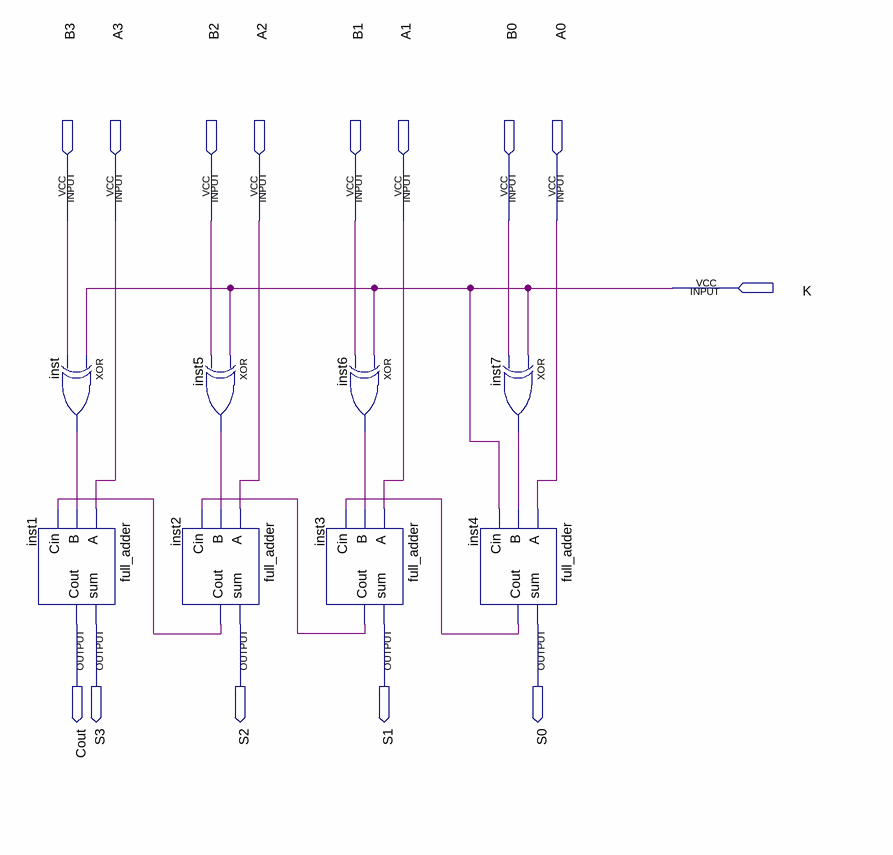
[diagram p0: schematic sheet]
// Quartus schematic FSA.bdf as structural Verilog: 8 symbols, 14 pins
module FSA (
  input  B3,
  input  A3,
  input  B2,
  input  A2,
  input  B1,
  input  A1,
  input  B0,
  input  A0,
  input  K,
  output Cout,
  output S3,
  output S2,
  output S1,
  output S0
);

  wire inst2_cout, inst3_cout, inst4_cout, inst5_out, inst6_out, inst7_out, inst_out;

  xor inst (inst_out, K, B3);
  full_adder inst1 (.A(A3), .B(inst_out), .Cin(inst2_cout), .sum(S3), .Cout(Cout));
  xor inst5 (inst5_out, K, B2);
  full_adder inst2 (.A(A2), .B(inst5_out), .Cin(inst3_cout), .sum(S2), .Cout(inst2_cout));
  xor inst6 (inst6_out, K, B1);
  full_adder inst3 (.A(A1), .B(inst6_out), .Cin(inst4_cout), .sum(S1), .Cout(inst3_cout));
  xor inst7 (inst7_out, K, B0);
  full_adder inst4 (.A(A0), .B(inst7_out), .Cin(K), .sum(S0), .Cout(inst4_cout));
endmodule
